# Altium schematic sheet laser_show_core.SchDoc
size A4
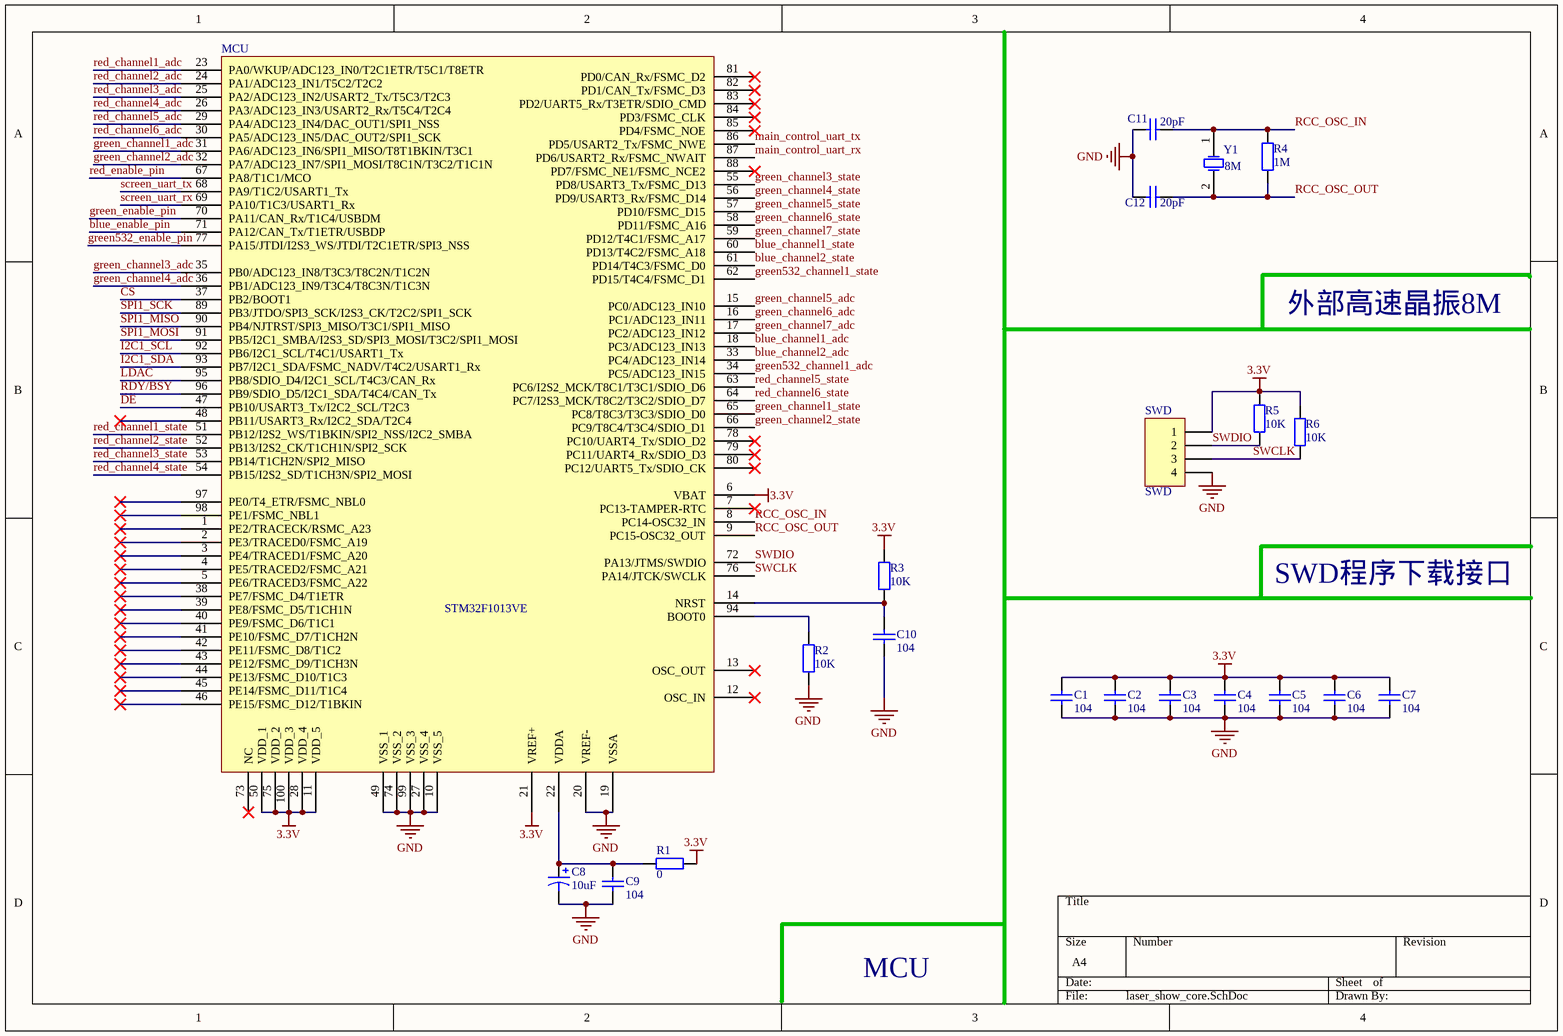
[diagram p0: laser_show_core.SchDoc]

## Parts
C1  104  [0603C]
C2  104  [0603C]
C3  104  [0603C]
C4  104  [0603C]
C5  104  [0603C]
C6  104  [0603C]
C7  104  [0603C]
C8  10uF  [0805CAP_POL]
C9  104  [0805C]
C10  104  [0805C]
C11  20pF  [0805C]
C12  20pF  [0805C]
MCU  STM32F1013VE  [LQFP100_L]
R1  0  [0603R]
R2  10K  [0603R]
R3  10K  [0805R]
R4  1M  [0805R]
R5  10K  [0805R]
R6  10K  [0805R]
SWD  SWD  [HDR1X4]
Y1  8M  [XTAL1]

## Nets
3.3V: C1.2 C2.2 C3.2 C4.2 C5.2 C6.2 C7.2 MCU.6(VBAT) MCU.11(VDD_5) MCU.21(VREF+) MCU.28(VDD_4) MCU.50(VDD_1) MCU.75(VDD_2) MCU.100(VDD_3) R1.2 R3.2 R5.2 R6.2 SWD.1
GND: C1.1 C2.1 C3.1 C4.1 C5.1 C6.1 C7.1 C8.2 C9.1 C10.1 C11.2 C12.2 MCU.10(VSS_5) MCU.19(VSSA) MCU.20(VREF-) MCU.27(VSS_4) MCU.49(VSS_1) MCU.74(VSS_2) MCU.99(VSS_3) R2.1 SWD.4
blue_channel1_adc: MCU.18(PC3/ADC123_IN13)
blue_channel1_state: MCU.60(PD13/T4C2/FSMC_A18)
blue_channel2_adc: MCU.33(PC4/ADC123_IN14)
blue_channel2_state: MCU.61(PD14/T4C3/FSMC_D0)
blue_enable_pin: MCU.71(PA12/CAN_Tx/T1ETR/USBDP)
CS: MCU.37(PB2/BOOT1)
DE: MCU.47(PB10/USART3_Tx/I2C2_SCL/T2C3)
green532_channel1_adc: MCU.34(PC5/ADC123_IN15)
green532_channel1_state: MCU.62(PD15/T4C4/FSMC_D1)
green532_enable_pin: MCU.77(PA15/JTDI/I2S3_WS/JTDI/T2C1ETR/SPI3_NSS)
green_channel1_adc: MCU.31(PA6/ADC123_IN6/SPI1_MISO/T8T1BKIN/T3C1)
green_channel1_state: MCU.65(PC8/T8C3/T3C3/SDIO_D0)
green_channel2_adc: MCU.32(PA7/ADC123_IN7/SPI1_MOSI/T8C1N/T3C2/T1C1N)
green_channel2_state: MCU.66(PC9/T8C4/T3C4/SDIO_D1)
green_channel3_adc: MCU.35(PB0/ADC123_IN8/T3C3/T8C2N/T1C2N)
green_channel3_state: MCU.55(PD8/USART3_Tx/FSMC_D13)
green_channel4_adc: MCU.36(PB1/ADC123_IN9/T3C4/T8C3N/T1C3N)
green_channel4_state: MCU.56(PD9/USART3_Rx/FSMC_D14)
green_channel5_adc: MCU.15(PC0/ADC123_IN10)
green_channel5_state: MCU.57(PD10/FSMC_D15)
green_channel6_adc: MCU.16(PC1/ADC123_IN11)
green_channel6_state: MCU.58(PD11/FSMC_A16)
green_channel7_adc: MCU.17(PC2/ADC123_IN12)
green_channel7_state: MCU.59(PD12/T4C1/FSMC_A17)
green_enable_pin: MCU.70(PA11/CAN_Rx/T1C4/USBDM)
I2C1_SCL: MCU.92(PB6/I2C1_SCL/T4C1/USART1_Tx)
I2C1_SDA: MCU.93(PB7/I2C1_SDA/FSMC_NADV/T4C2/USART1_Rx)
~{LDA}C: MCU.95(PB8/SDIO_D4/I2C1_SCL/T4C3/CAN_Rx)
main_control_uart_rx: MCU.87(PD6/USART2_Rx/FSMC_NWAIT)
main_control_uart_tx: MCU.86(PD5/USART2_Tx/FSMC_NWE)
RCC_OSC_IN: C11.1 MCU.8(PC14-OSC32_IN) R4.1 Y1.1(OSC1)
RCC_OSC_OUT: C12.1 MCU.9(PC15-OSC32_OUT) R4.2 Y1.2(OSC2)
RDY/~{BSY}: MCU.96(PB9/SDIO_D5/I2C1_SDA/T4C4/CAN_Tx)
red_channel1_adc: MCU.23(PA0/WKUP/ADC123_IN0/T2C1ETR/T5C1/T8ETR)
red_channel1_state: MCU.51(PB12/I2S2_WS/T1BKIN/SPI2_NSS/I2C2_SMBA)
red_channel2_adc: MCU.24(PA1/ADC123_IN1/T5C2/T2C2)
red_channel2_state: MCU.52(PB13/I2S2_CK/T1CH1N/SPI2_SCK)
red_channel3_adc: MCU.25(PA2/ADC123_IN2/USART2_Tx/T5C3/T2C3)
red_channel3_state: MCU.53(PB14/T1CH2N/SPI2_MISO)
red_channel4_adc: MCU.26(PA3/ADC123_IN3/USART2_Rx/T5C4/T2C4)
red_channel4_state: MCU.54(PB15/I2S2_SD/T1CH3N/SPI2_MOSI)
red_channel5_adc: MCU.29(PA4/ADC123_IN4/DAC_OUT1/SPI1_NSS)
red_channel5_state: MCU.63(PC6/I2S2_MCK/T8C1/T3C1/SDIO_D6)
red_channel6_adc: MCU.30(PA5/ADC123_IN5/DAC_OUT2/SPI1_SCK)
red_channel6_state: MCU.64(PC7/I2S3_MCK/T8C2/T3C2/SDIO_D7)
red_enable_pin: MCU.67(PA8/T1C1/MCO)
screen_uart_rx: MCU.69(PA10/T1C3/USART1_Rx)
screen_uart_tx: MCU.68(PA9/T1C2/USART1_Tx)
SPI1_MISO: MCU.90(PB4/NJTRST/SPI3_MISO/T3C1/SPI1_MISO)
SPI1_MOSI: MCU.91(PB5/I2C1_SMBA/I2S3_SD/SPI3_MOSI/T3C2/SPI1_MOSI)
SPI1_SCK: MCU.89(PB3/JTDO/SPI3_SCK/I2S3_CK/T2C2/SPI1_SCK)
SWCLK: MCU.76(PA14/JTCK/SWCLK) R6.1 SWD.3
SWDIO: MCU.72(PA13/JTMS/SWDIO) R5.1 SWD.2
NetC8_1: C8.1 C9.2 MCU.22(VDDA) R1.1
NetC10_2: C10.2 MCU.14(NRST) R3.1
NetMCU_94: MCU.94(BOOT0) R2.2

Not connected (* = marked no-connect by the designer): MCU 1(PE2/TRACECK/RSMC_A23)* 2(PE3/TRACED0/FSMC_A19)* 3(PE4/TRACED1/FSMC_A20)* 4(PE5/TRACED2/FSMC_A21)* 5(PE6/TRACED3/FSMC_A22)* 7(PC13-TAMPER-RTC)* 12(OSC_IN)* 13(OSC_OUT)* 38(PE7/FSMC_D4/T1ETR)* 39(PE8/FSMC_D5/T1CH1N)* 40(PE9/FSMC_D6/T1C1)* 41(PE10/FSMC_D7/T1CH2N)* 42(PE11/FSMC_D8/T1C2)* 43(PE12/FSMC_D9/T1CH3N)* 44(PE13/FSMC_D10/T1C3)* 45(PE14/FSMC_D11/T1C4)* 46(PE15/FSMC_D12/T1BKIN)* 48(PB11/USART3_Rx/I2C2_SDA/T2C4)* 73(NC)* 78(PC10/UART4_Tx/SDIO_D2)* 79(PC11/UART4_Rx/SDIO_D3)* 80(PC12/UART5_Tx/SDIO_CK)* 81(PD0/CAN_Rx/FSMC_D2)* 82(PD1/CAN_Tx/FSMC_D3)* 83(PD2/UART5_Rx/T3ETR/SDIO_CMD)* 84(PD3/FSMC_CLK)* 85(PD4/FSMC_NOE)* 88(PD7/FSMC_NE1/FSMC_NCE2)* 97(PE0/T4_ETR/FSMC_NBL0)* 98(PE1/FSMC_NBL1)*

## Notes on the sheet
- 外部高速晶振8M
- SWD程序下载接口
- MCU

## Library data of the parts
C1-C7 C9 = CAP: capacitance
C8 = CAP_Polar: Cap polar
C10-C12 = Cap: capacitance
MCU = STM32F103VET6: STM32F1013VET6
R1 R2 R5 R6 = RES: resistor
R3 R4 = Res: resistor
SWD = Header 4: Header, 4-Pin; LatestRevisionDate: 17-Jul-2002; LatestRevisionNote: Re-released for DXP Platform.; Publisher: Altium Limited
Y1 = 8M: crystal